# Altium schematic sheet Sheet1.SchDoc
size A
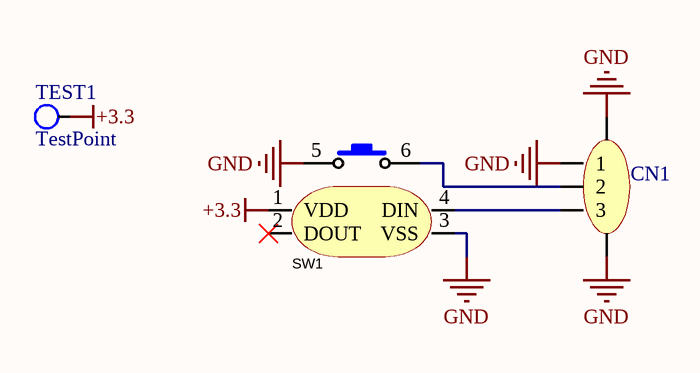
[diagram p0: Sheet1.SchDoc]

## Parts
CN1  HDGC1002WR-S-3P  [SH1.0_3P]  (value not drawn)
SW1  佳达隆带灯热插拔矮轴  [Gateron_Switch_Direct]  (value not drawn)
TEST1  TestPoint  [TestPoint_0402]

## Nets
+3.3: SW1.1(VDD) TEST1.1
GND: CN1.1 CN1.4 CN1.5 SW1.3(VSS) SW1.5
NetCN1_2: CN1.2 SW1.6
NetCN1_3: CN1.3 SW1.4(DIN)

Not connected (* = marked no-connect by the designer): SW1 2(DOUT)*

## Library data of the parts
CN1 = 3P端子: Manufacturer: HDGC(华德共创); Add into BOM: yes; Name: HDGC1002WR-S-3P; Symbol: HDGC1002WR-S-3P; Device: HDGC1002WR-S-3P; LCSC Part Name: SH1.0针座卧贴 3P; Supplier Part: C2936213; Manufacturer Part: HDGC1002WR-S-3P; Supplier Footprint: SMD,P=1mm; JLCPCB Part Class: 扩展库; Datasheet: https://atta.szlcsc.com/upload/public/pdf/source/20211229/E8A09E85670B5E97244D2008A24D97FE.pdf; Supplier: LCSC; Convert to PCB: yes
SW1 = Gateron_Switch_Low: Add into BOM: yes; Symbol: 带灯热插拔矮轴; Device: 带灯热插拔矮轴; Convert to PCB: yes